# Altium schematic sheet Microcontroller.SchDoc
size A3
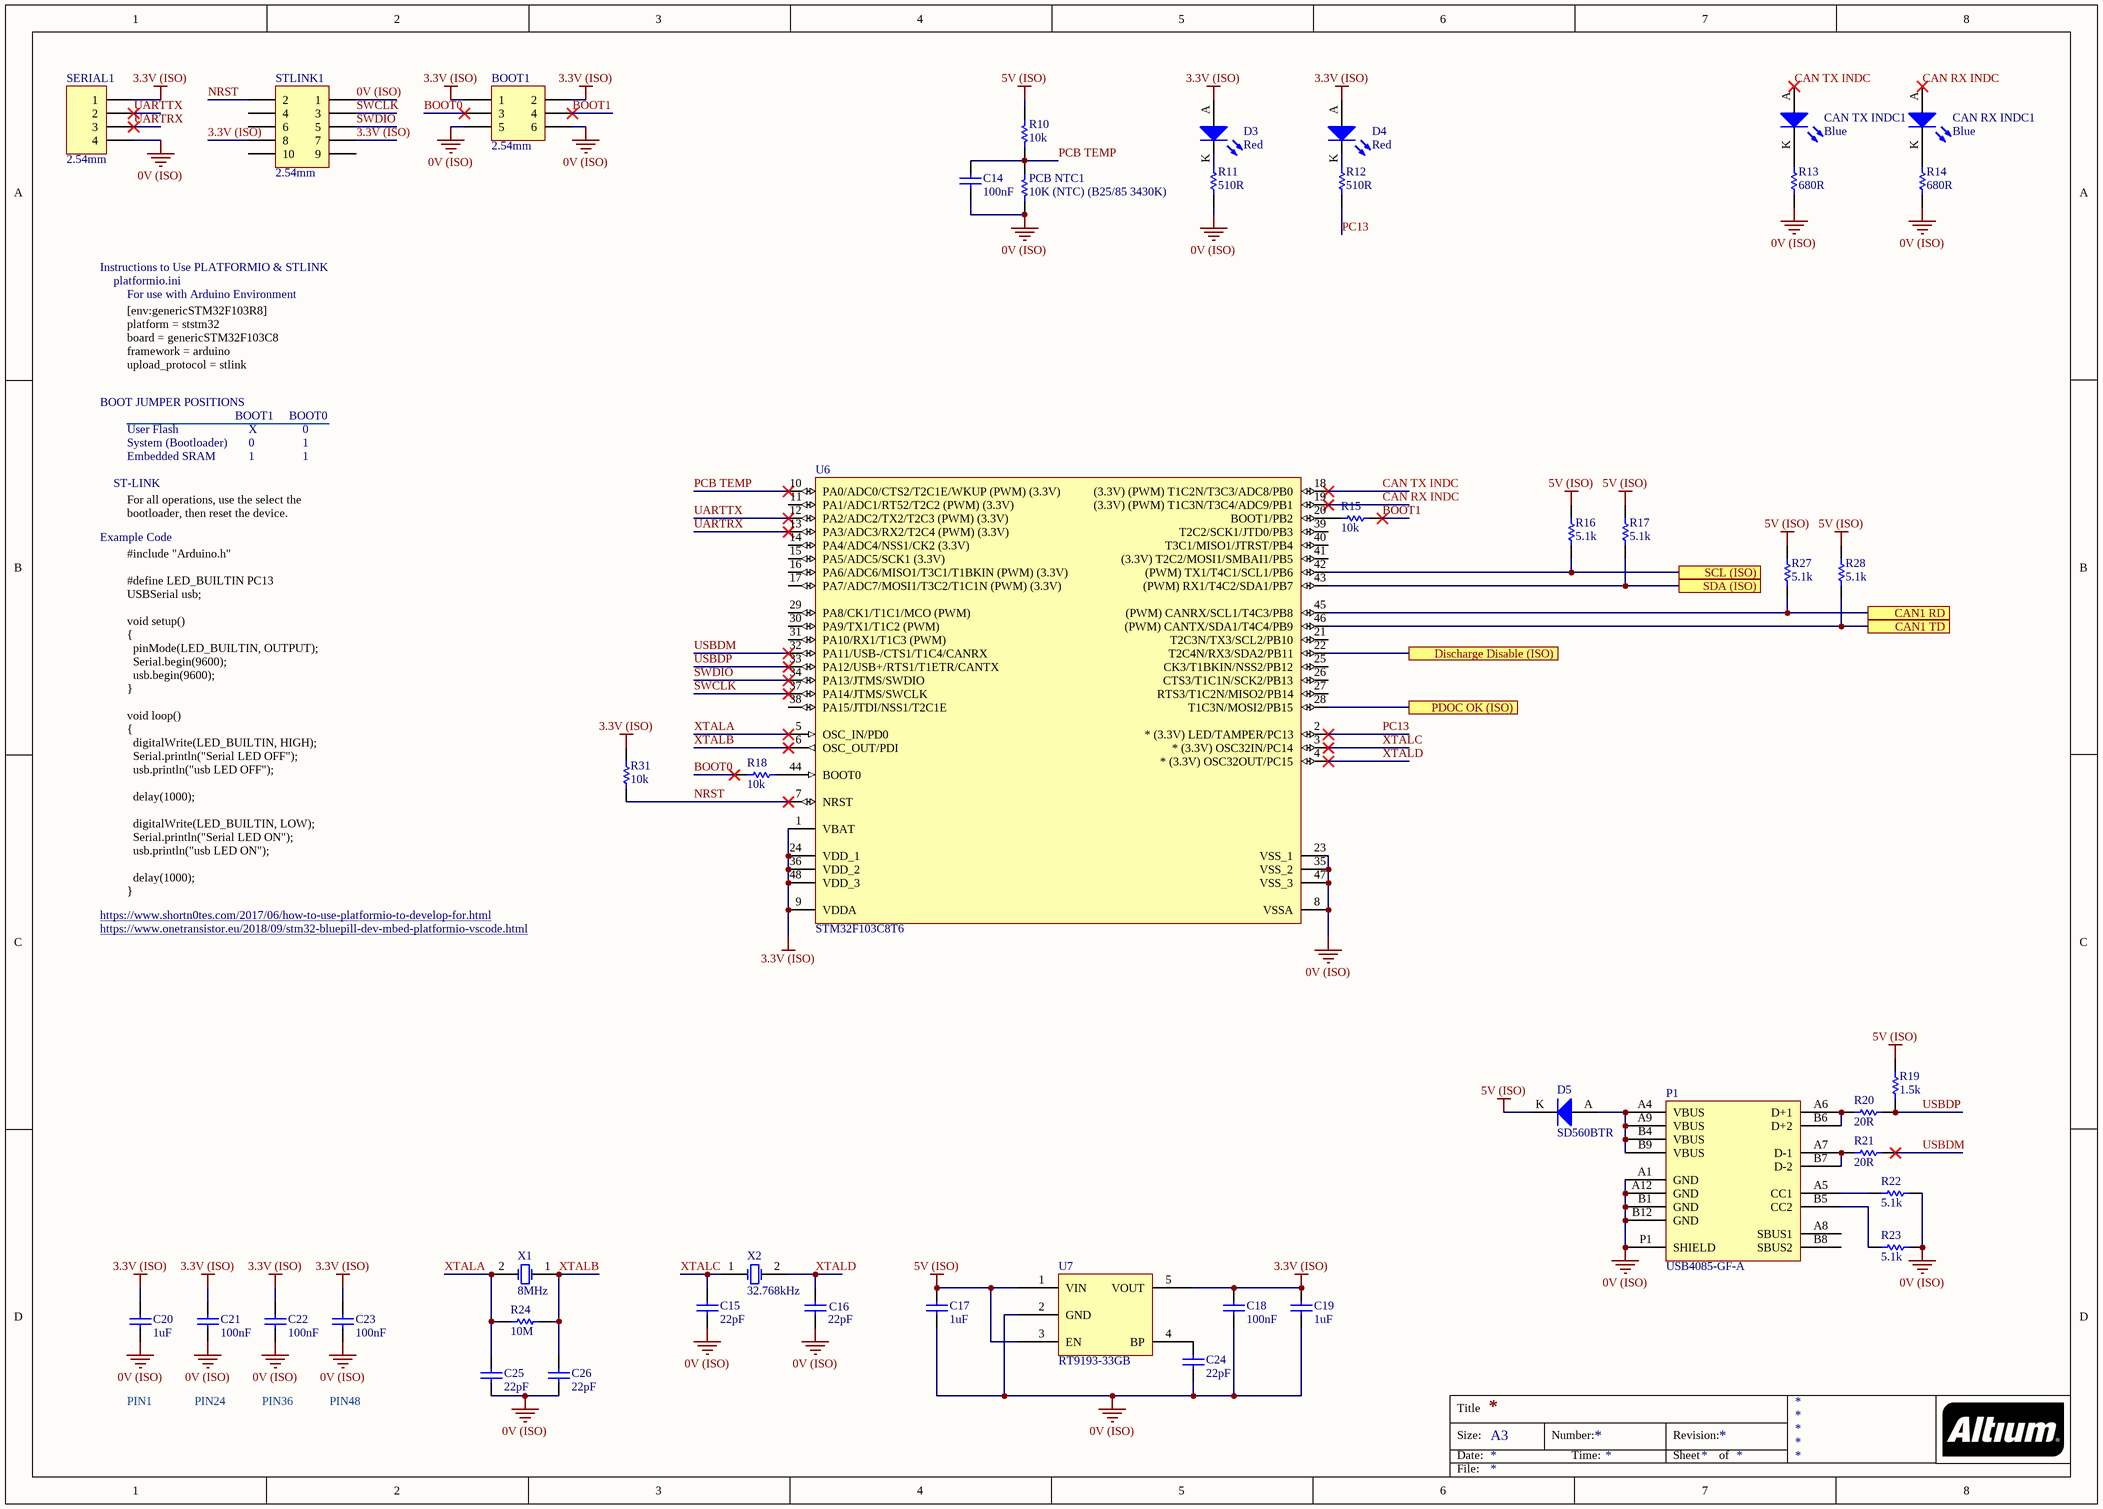
[diagram p0: Microcontroller.SchDoc]

## Parts
BOOT1  2.54mm  [TH 2.54mm Header 2x3]
C14  100nF  [0805]
C15  22pF  [0805]
C16  22pF  [0805]
C17  1uF  [0805]
C18  100nF  [0805]
C19  1uF  [0805]
C20  1uF  [0805]
C21  100nF  [0805]
C22  100nF  [0805]
C23  100nF  [0805]
C24  22pF  [0805]
C25  22pF  [0805]
C26  22pF  [0805]
CAN_RX_INDC1  Blue  [0805 LED]
CAN_TX_INDC1  Blue  [0805 LED]
D3  Red  [0805 LED]
D4  Red  [0805 LED]
D5  SD560BTR  [SMB Diode]
P1  USB4085-GF-A  [USB4085-GF-A]
PCB_NTC1  10K (NTC) (B25/85 3430K)  [0805]
R10  10k  [0805]
R11  510R  [0805]
R12  510R  [0805]
R13  680R  [0805]
R14  680R  [0805]
R15  10k  [0805]
R16  5.1k  [0805]
R17  5.1k  [0805]
R18  10k  [0805]
R19  1.5k  [0805]
R20  20R  [0805]
R21  20R  [0805]
R22  5.1k  [0805]
R23  5.1k  [0805]
R24  10M  [0805]
R27  5.1k  [0805]
R28  5.1k  [0805]
R31  10k  [0805]
SERIAL1  2.54mm  [TH 2.54mm Header 1x4]
STLINK1  2.54mm  [TH 2.54mm Header 2x5]
U6  STM32F103C8T6  [STM 48-LQFP]
U7  RT9193-33GB  [RICHTEK SOT-23-5]
X1  8MHz  [Abracon HC-49/US]
X2  32.768kHz  [EPSON 2-SMD]

## Ports
CAN1 RD, CAN1 TD, Discharge Disable (ISO), PDOC OK (ISO), SCL (ISO), SDA (ISO)

## Nets
0V (ISO): BOOT1.5 BOOT1.6 C14.1 C15.1 C16.1 C17.1 C18.1 C19.1 C20.1 C21.1 C22.1 C23.1 C24.1 C25.1 C26.1 P1.A1(GND) P1.A12(GND) P1.B1(GND) P1.B12(GND) P1.P1(SHIELD) PCB_NTC1.1 R11.1 R13.1 R14.1 R22.2 R23.2 SERIAL1.4 STLINK1.1 U6.8(VSSA) U6.23(VSS_1) U6.35(VSS_2) U6.47(VSS_3) U7.2(GND)
3.3V (ISO): BOOT1.1 BOOT1.2 C18.2 C19.2 C20.2 C21.2 C22.2 C23.2 D3.A D4.A R31.2 SERIAL1.1 STLINK1.7 STLINK1.8 U6.1(VBAT) U6.9(VDDA) U6.24(VDD_1) U6.36(VDD_2) U6.48(VDD_3) U7.5(VOUT)
5V (ISO): C17.2 D5.K R10.2 R16.2 R17.2 R19.2 R27.2 R28.2 U7.1(VIN) U7.3(EN)
BOOT0: BOOT1.3 R18.1
BOOT1: BOOT1.4 R15.2
CAN1 RD: R27.1 U6.45((PWM)_CANRX/SCL1/T4C3/PB8) ; port CAN1 RD
CAN1 TD: R28.1 U6.46((PWM)_CANTX/SDA1/T4C4/PB9) ; port CAN1 TD
CAN RX INDC: CAN_RX_INDC1.A U6.19((3.3V)_(PWM)_T1C3N/T3C4/ADC9/PB1)
CAN TX INDC: CAN_TX_INDC1.A U6.18((3.3V)_(PWM)_T1C2N/T3C3/ADC8/PB0)
Discharge Disable (ISO): U6.22(T2C4N/RX3/SDA2/PB11) ; port Discharge Disable (ISO)
NRST: R31.1 STLINK1.2 U6.7(NRST)
PC13: R12.1 U6.2(*_(3.3V)_LED/TAMPER/PC13)
PCB TEMP: C14.2 PCB_NTC1.2 R10.1 U6.10(PA0/ADC0/CTS2/T2C1E/WKUP_(PWM)_(3.3V))
PDOC OK (ISO): U6.28(T1C3N/MOSI2/PB15) ; port PDOC OK (ISO)
SCL (ISO): R16.1 U6.42((PWM)_TX1/T4C1/SCL1/PB6) ; port SCL (ISO)
SDA (ISO): R17.1 U6.43((PWM)_RX1/T4C2/SDA1/PB7) ; port SDA (ISO)
SWCLK: STLINK1.3 U6.37(PA14/JTMS/SWCLK)
SWDIO: STLINK1.5 U6.34(PA13/JTMS/SWDIO)
UARTRX: SERIAL1.3 U6.13(PA3/ADC3/RX2/T2C4_(PWM)_(3.3V))
UARTTX: SERIAL1.2 U6.12(PA2/ADC2/TX2/T2C3_(PWM)_(3.3V))
USBDM: R21.2 U6.32(PA11/USB-/CTS1/T1C4/CANRX)
USBDP: R19.1 R20.2 U6.33(PA12/USB+/RTS1/T1ETR/CANTX)
XTALA: C25.2 R24.2 U6.5(OSC_IN/PD0) X1.2(OSC2)
XTALB: C26.2 R24.1 U6.6(OSC_OUT/PDI) X1.1(OSC1)
XTALC: C15.2 U6.3(*_(3.3V)_OSC32IN/PC14) X2.1(OSC1)
XTALD: C16.2 U6.4(*_(3.3V)_OSC32OUT/PC15) X2.2(OSC2)
NetC24_2: C24.2 U7.4(BP)
NetCAN_RX_INDC1_K: CAN_RX_INDC1.K R14.2
NetCAN_TX_INDC1_K: CAN_TX_INDC1.K R13.2
NetD3_K: D3.K R11.2
NetD4_K: D4.K R12.2
NetD5_A: D5.A P1.A4(VBUS) P1.A9(VBUS) P1.B4(VBUS) P1.B9(VBUS)
NetP1_A5: P1.A5(CC1) R22.1
NetP1_A6: P1.A6(D+1) P1.B6(D+2) R20.1
NetP1_A7: P1.A7(D-1) P1.B7(D-2) R21.1
NetP1_B5: P1.B5(CC2) R23.1
NetR15_1: R15.1 U6.20(BOOT1/PB2)
NetR18_2: R18.2 U6.44(BOOT0)

Not connected (* = marked no-connect by the designer): P1 A8(SBUS1) B8(SBUS2); STLINK1 4 6 9 10; U6 11(PA1/ADC1/RT52/T2C2_(PWM)_(3.3V)) 14(PA4/ADC4/NSS1/CK2_(3.3V)) 15(PA5/ADC5/SCK1_(3.3V)) 16(PA6/ADC6/MISO1/T3C1/T1BKIN_(PWM)_(3.3V)) 17(PA7/ADC7/MOSI1/T3C2/T1C1N_(PWM)_(3.3V)) 21(T2C3N/TX3/SCL2/PB10) 25(CK3/T1BKIN/NSS2/PB12) 26(CTS3/T1C1N/SCK2/PB13) 27(RTS3/T1C2N/MISO2/PB14) 29(PA8/CK1/T1C1/MCO_(PWM)) 30(PA9/TX1/T1C2_(PWM)) 31(PA10/RX1/T1C3_(PWM)) 38(PA15/JTDI/NSS1/T2C1E) 39(T2C2/SCK1/JTD0/PB3) 40(T3C1/MISO1/JTRST/PB4) 41((3.3V)_T2C2/MOSI1/SMBAI1/PB5)

## Notes on the sheet
- Instructions to Use PLATFORMIO & STLINK
- platformio.ini
- For use with Arduino Environment
- BOOT JUMPER POSITIONS
- [env:genericSTM32F103R8]
  platform = ststm32
  board = genericSTM32F103C8
  framework = arduino
  upload_protocol = stlink
- User Flash
- System (Bootloader)
- BOOT1
- X
- 0
- BOOT0
- 1
- ST-LINK
- Embedded SRAM
- For all operations, use the select the bootloader, then reset the device.
- Example Code
- https://www.shortn0tes.com/2017/06/how-to-use-platformio-to-develop-for.html
- #include "Arduino.h"
  #define LED_BUILTIN PC13
  USBSerial usb;
  void setup()
  {
  pinMode(LED_BUILTIN, OUTPUT);
  Serial.begin(9600);
  usb.begin(9600);
  }
  void loop()
  {
  digitalWrite(LED_BUILTIN, HIGH);
  Serial.println("Serial LED OFF");
  usb.println("usb LED OFF");
  delay(1000);
  digitalWrite(LED_BUILTIN, LOW);
  Serial.println("Serial LED ON");
  usb.println("usb LED ON");
  delay(1000);
  }
- https://www.onetransistor.eu/2018/09/stm32-bluepill-dev-mbed-platformio-vscode.html
- PIN1
- PIN24
- PIN36
- PIN48
- Title
- Size:
- Date:
- A3
- Number:
- Time:
- Revision:
- Sheet
- of
- File:

## Library data of the parts
BOOT1 = TH 2.54mm Header 2x3: Positions: 6; Angle: 0; Flange: No; Contact: NA; Part Number: TH 2.54mm Header 2x3; Pitch: 2.54mm; Row Spacing: 2.54mm
C14 C18 C21-C23 = GCM21BR71H104KA37L: Manufacturer: muRata; Tolerance: ±10%; Material: X7R; Rated Voltage: 50V; Part Number: GCM21BR71H104KA37L; Value: 100nF; Digikey Part Number: 490-6064-1-ND
C15 C16 C24-C26 = GRM21A5C2E220JW01D: Manufacturer: muRata; Tolerance: ±5%; Material: C0G, NP0; Rated Voltage: 250V; Part Number: GRM21A5C2E220JW01D; Value: 22pF; Digikey Part Number: 490-5534-1-ND
C17 C19 C20 = AC0805KKX7R8BB105: Manufacturer: YAGEO; Tolerance: 10%; Material: X7R; Rated Voltage: 25V; Part Number: AC0805KKX7R8BB105; Value: 1uF
CAN_RX_INDC1 CAN_TX_INDC1 = SML-MN2BCTT86C: LED BLUE CLEAR 2012 SMD; Manufacturer: ROHM Semiconductor; Part Number: SML-MN2BCTT86C; Colour: Blue; Digikey Part Number: 846-1207-1-ND; Digikey Link: https://www.digikey.com/product-detail/en/rohm-semiconductor/SMLMN2BCTT86C/846-1207-1-ND/6057239
D3 D4 = SML-210LTT86: Red LED Indication - Discrete 1.75V 0805 (2012 Metric); Manufacturer: ROHM Semiconductor; Part Number: SML-210LTT86; Colour: Red; Digikey Part Number: 511-1286-1-ND; Digikey Link: https://www.digikey.com/product-detail/en/rohm-semiconductor/SML-210LTT86/511-1286-1-ND/637099
D5 = SD560BTR: 1.2V_F 600V 5A SMB; Manufacturer: SMC Diode Solutions; Part Number: SD560BTR; Digikey Part Number: 1655-1530-2-ND; Digikey Link: https://www.digikey.com/product-detail/en/smc-diode-solutions/SD560BTR/1655-1530-2-ND/6022620
P1 = USB4085-GF-A: USB - C (Type - C) USB 2.0 Receptacle Connector 16 Position Through Hole, Right Angle; Angle: 90; Part Number: USB4085-GF-A; Digikey Part Number: 2073-USB4085-GF-ACT-ND; Digikey Link: https://www.digikey.ee/product-detail/en/gct/USB4085-GF-A/2073-USB4085-GF-ACT-ND/9859733
PCB_NTC1 = NTCS0805E3103FLT: Manufacturer: Vishay Beyschlag; Tolerance: 0.01; Rated Voltage: 210mW; Part Number: NTCS0805E3103FLT; Value: 10K (NTC) (B25/85 3430K); Digikey Part Number: BC2733CT-ND
R10 R15 R18 R31 = RC0805FR0710KL: Manufacturer: YAGEO; Tolerance: 0.01; Rated Voltage: 0.125W; Part Number: RC0805FR0710KL; Value: 10k; Material: FR-07; Digikey Part Number: 311-10.0KCRCT-ND
R11 R12 = RC0805FR07510RL: Manufacturer: YAGEO; Tolerance: 0.01; Rated Voltage: 0.125W; Part Number: RC0805FR07510RL; Value: 510R; Material: FR-07; Digikey Part Number: 311-510CRCT-ND
R13 R14 = RC0805FR07680RL: Manufacturer: YAGEO; Tolerance: 0.01; Rated Voltage: 0.125W; Part Number: RC0805FR07680RL; Value: 680R; Material: FR-07; Digikey Part Number: 311-680CRCT-ND
R16 R17 R22 R23 R27 R28 = RC0805FR075K1L: Manufacturer: YAGEO; Tolerance: 0.01; Rated Voltage: 0.125W; Part Number: RC0805FR075K1L; Value: 5.1k; Material: FR-07; Digikey Part Number: 311-5.10KCRCT-ND
R19 = RC0805FR071K5L: Manufacturer: YAGEO; Tolerance: 0.01; Rated Voltage: 0.125W; Part Number: RC0805FR071K5L; Value: 1.5k; Material: FR-07; Digikey Part Number: 311-1.50KCRCT-ND
R20 R21 = RC0805FR0720RL: Manufacturer: YAGEO; Tolerance: 0.01; Rated Voltage: 0.125W; Part Number: RC0805FR0720RL; Value: 20R; Material: FR-07; Digikey Part Number: 311-20.0CRCT-ND
R24 = RC0805FR0710ML: Manufacturer: YAGEO; Tolerance: 0.01; Rated Voltage: 0.125W; Part Number: RC0805FR0710ML; Value: 10M; Material: FR-07; Digikey Part Number: 311-10.0MCRCT-ND
SERIAL1 = TH 2.54mm Header 1x4: Positions: 4; Angle: 0; Flange: No; Contact: NA; Part Number: TH 2.54mm Header 1x4; Pitch: 2.54mm; Row Spacing: 2.54mm
STLINK1 = TH 2.54mm Header 2x5: Positions: 10; Angle: 0; Flange: No; Contact: NA; Part Number: TH 2.54mm Header 2x5; Pitch: 2.54mm; Row Spacing: 2.54mm
U6 = STM32F103C8T6: ARM® Cortex®-M3 STM32F1 Microcontroller IC 32-Bit 72MHz 64KB (64K x 8) FLASH; Manufacturer: STMicroelectronics; Part Number: STM32F103C8T6; Digikey Part Number: 497-6063-ND; Digikey Link: https://www.digikey.com/product-detail/en/stmicroelectronics/STM32F103C8T6/497-6063-ND/1646338
U7 = RT9193-33GB: IC REG LINEAR 3.3V 300MA SOT23-5; Manufacturer: Richtek; Part Number: RT9193-33GB; Digikey Part Number: 1028-1014-1-ND; Digikey Link: https://www.digikey.com/products/en?keywords=1028-1014-1-ND
X1 = ABLS-8.000MHZ-B4-T: Manufacturer: Abracon LLC; Load Capacitance: 18pF; ESR: 80R; Part Number: ABLS-8.000MHZ-B4-T; Value: 8MHz; Digikey Part Number: 535-10212-2-ND; Digikey Link: https://www.digikey.com/product-detail/en/abracon-llc/ABLS-8.000MHZ-B4-T/535-10212-2-ND/2184155
X2 = FC-135 32.7680KA-A5: Manufacturer: EPSON; Load Capacitance: 12.5pF; ESR: 70k; Part Number: FC-135 32.7680KA-A5; Value: 32.768kHz; Digikey Part Number: SER4103TR-ND; Digikey Link: https://www.digikey.com/product-detail/en/epson/FC-135-32.7680KA-A5/SER4103TR-ND/5259895